# EAGLE design Controller (EAGLE 8.3.2)
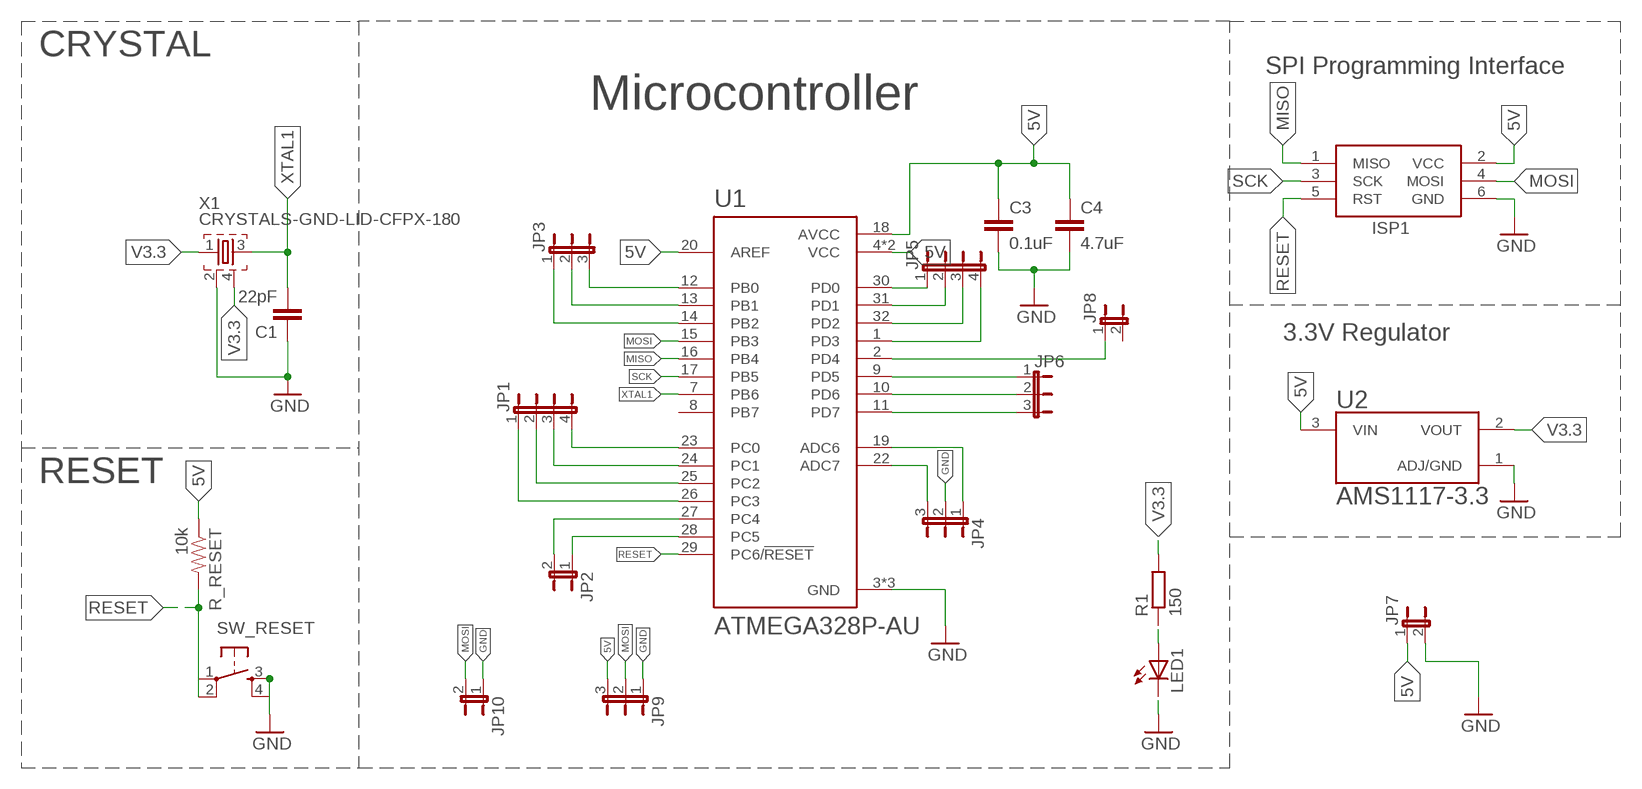
[diagram p0: schematic, sheet 1]

## Parts
C1  22pF  CAP0603-CAP  [0603-CAP]
C3  0.1uF  CAP0603-CAP  [0603-CAP]
C4  4.7uF  CAP0603-CAP  [0603-CAP]
ISP1  AVRISP-6  [AVRISP]
JP1  JP4E  [JP4]
JP2  JP1E  [JP1]
JP3  JP2E  [JP2]
JP4  JP2E  [JP2]
JP5  JP4E  [JP4]
JP6  JP2E  [JP2]
JP7  JP1E  [JP1]
JP8  JP1E  [JP1]
JP9  JP2E  [JP2]
JP10  JP1E  [JP1]
LED1  LEDSML0603  [SML0603]
R1  150  R-EU_R0603  [R0603]
R_RESET  10k  RESISTOR0603-RES  [0603-RES]
SW_RESET  TAC_SWITCHPTH  [TACTILE-PTH]
U1  ATMEGA328P-AU  [QFP80P900X900X120-32N]
U2  AMS1117-3.3  [SOT229P700X180-4N]
X1  CRYSTALS-GND-LID-CFPX-180  [3.4X2.7-4-PAD]

## Nets
5V: C3.1 C4.1 ISP1.2(VCC) JP7.1 JP9.3 R_RESET.1 U1.4(VCC) U1.6(VCC) U1.18(AVCC) U1.20(AREF) U2.3(VIN)
GND: C1.1 C3.2 C4.2 ISP1.6(GND) JP4.2 JP7.2 JP9.1 JP10.1 LED1.C SW_RESET.3 SW_RESET.4 U1.3(GND) U1.5(GND) U1.21(GND) U2.1(ADJ/GND) X1.2
MISO: ISP1.1(MISO) U1.16(PB4)
MOSI: ISP1.4(MOSI) JP9.2 JP10.2 U1.15(PB3)
N$1: LED1.A R1.1
N$2: JP1.4 U1.23(PC0)
N$3: JP1.3 U1.24(PC1)
N$4: JP1.2 U1.25(PC2)
N$5: JP1.1 U1.26(PC3)
N$6: JP2.2 U1.27(PC4)
N$7: SW_RESET.1
N$8: JP2.1 U1.28(PC5)
N$9: JP3.3 U1.12(PB0)
N$10: JP3.2 U1.13(PB1)
N$11: JP3.1 U1.14(PB2)
N$12: JP4.3 U1.22(ADC7)
N$13: JP4.1 U1.19(ADC6)
N$14: JP5.1 U1.30(PD0)
N$15: JP5.2 U1.31(PD1)
N$16: JP5.3 U1.32(PD2)
N$17: JP5.4 U1.1(PD3)
N$18: JP8.1 U1.2(PD4)
N$19: JP6.1 U1.9(PD5)
N$20: JP6.2 U1.10(PD6)
N$21: JP6.3 U1.11(PD7)
RESET: ISP1.5(RST) R_RESET.2 SW_RESET.2 U1.29(PC6/!RESET)
SCK: ISP1.3(SCK) U1.17(PB5)
V3.3: R1.2 U2.2(VOUT) X1.1 X1.4
XTAL1: C1.2 U1.7(PB6) X1.3
Unconnected: JP8.2 U1.8(PB7)

## Notes on the sheet
- CRYSTAL
- SPI Programming Interface
- Microcontroller
- 3.3V Regulator
- RESET

## Library data of the parts
C1 C3 C4 = SparkFun:CAP: Capacitor Standard 0603 ceramic capacitor, and 0.1" leaded capacitor.
ISP1 = adafruit:AVRISP: AVR ISP HEADER Standard 6 pin header for AVR programming
JP1 JP5 = jumper:JP4E: JUMPER
JP2 JP7 JP8 JP10 = jumper:JP1E: JUMPER
JP3 JP4 JP6 JP9 = jumper:JP2E: JUMPER
LED1 = led:LED: LED OSRAM: - CHIPLED LG R971, LG N971, LY N971, LG Q971, LY Q971, LO R971, LY R971 LH N974, LH R974 LS Q976, LO Q976, LY Q976 LO Q996 - Hyper CHIPLED LW Q18S LB Q993, LB Q99A, LB R99A - SideLED LS A670, LO A670, LY A670, LG A670, LP A670 LB A673, LV A673, LT A673, LW A673 LH A674 LY A675 LS A676, LA A676, LO A676, LY A676, LW A676 LS A679, LY A679, LG A679 - Hyper Micro SIDELED® LS Y876, LA Y876, LO Y876, LY Y876 LT Y87S - SmartLED LW L88C, LW L88S LB L89C, LB L89S, LG L890 LS L89K, LO L89K, LY L89K LS L896, LA L896, LO L896, LY L896 - TOPLED LS T670, LO T670, LY T670, LG T670, LP T670 LSG T670, LSP T670, LSY T670, LOP T670, LYG T670 LG T671, LOG T671, LSG T671 LB T673, LV T673, LT T673, LW T673 LH T674 LS T676, LA T676, LO T676, LY T676, LB T676, LH T676, LSB T676, LW T676 LB T67C, LV T67C, LT T67C, LS T67K, LO T67K, LY T67K, LW E67C LS E67B, LA E67B, LO E67B, LY E67B, LB E67C, LV E67C, LT E67C LW T67C LS T679, LY T679, LG T679 LS T770, LO T770, LY T770, LG T770, LP T770 LB T773, LV T773, LT T773, LW T773 LH T774 LS E675, LA E675, LY E675, LS T675 LS T776, LA T776, LO T776, LY T776, LB T776 LHGB T686 LT T68C, LB T68C - Hyper Mini TOPLED® LB M676 - Mini TOPLED Santana® LG M470 LS M47K, LO M47K, LY M47K Source: http://www.osram.convergy.de LUXEON: - LUMILED® LXK2-PW12-R00, LXK2-PW12-S00, LXK2-PW14-U00, LXK2-PW14-V00 LXK2-PM12-R00, LXK2-PM12-S00, LXK2-PM14-U00 LXK2-PE12-Q00, LXK2-PE12-R00, LXK2-PE12-S00, LXK2-PE14-T00, LXK2-PE14-U00 LXK2-PB12-K00, LXK2-PB12-L00, LXK2-PB12-M00, LXK2-PB14-N00, LXK2-PB14-P00, LXK2-PB14-Q00 LXK2-PR12-L00, LXK2-PR12-M00, LXK2-PR14-Q00, LXK2-PR14-R00 LXK2-PD12-Q00, LXK2-PD12-R00, LXK2-PD12-S00 LXK2-PH12-R00, LXK2-PH12-S00 LXK2-PL12-P00, LXK2-PL12-Q00, LXK2-PL12-R00 Source: www.luxeon.com KINGBRIGHT: KA-3528ASYC Source: www.kingbright.com
R1 = resistor:R-EU_: RESISTOR, European symbol
R_RESET = SparkFun:RESISTOR: Resistor Basic schematic elements and footprints for 0603, 1206, and PTH resistors.
SW_RESET = SparkFun:TAC_SWITCH: Momentary Switch Button commonly used for reset or general input. Spark Fun Electronics SKU : COM-00097
U1 = ATMEGA328P-AU:ATMEGA328P-AU: ATmega Series 20 MHz 32 KB Flash 2 KB SRAM 8-Bit Microcontroller - TQFP-32; AVAILABILITY: Good; DESCRIPTION: Microcontroller Mcu, 8 Bit, Atmega, 20mhz, Tqfp-32; MF: Microchip; MP: ATMEGA328P-AU; PACKAGE: TQFP-32 Microchip; PRICE: 2.19 USD
U2 = AMS1117-3.3:AMS1117-3.3: Sot223/Pkg 1-Amp 3.3-Volt Low Drop Out Voltage Regulatator; AVAILABILITY: Unavailable; DESCRIPTION: Sot223/Pkg 1-Amp 3.3-Volt Low Drop Out Voltage Regulatator; MF: Advanced Monolithic Systems; MP: AMS1117-3.3; PACKAGE: None; PRICE: None
X1 = IQD-Frequency-Products:CRYSTALS-GND-LID: CRYSTALS WITH CAN GROUNDED

## Board
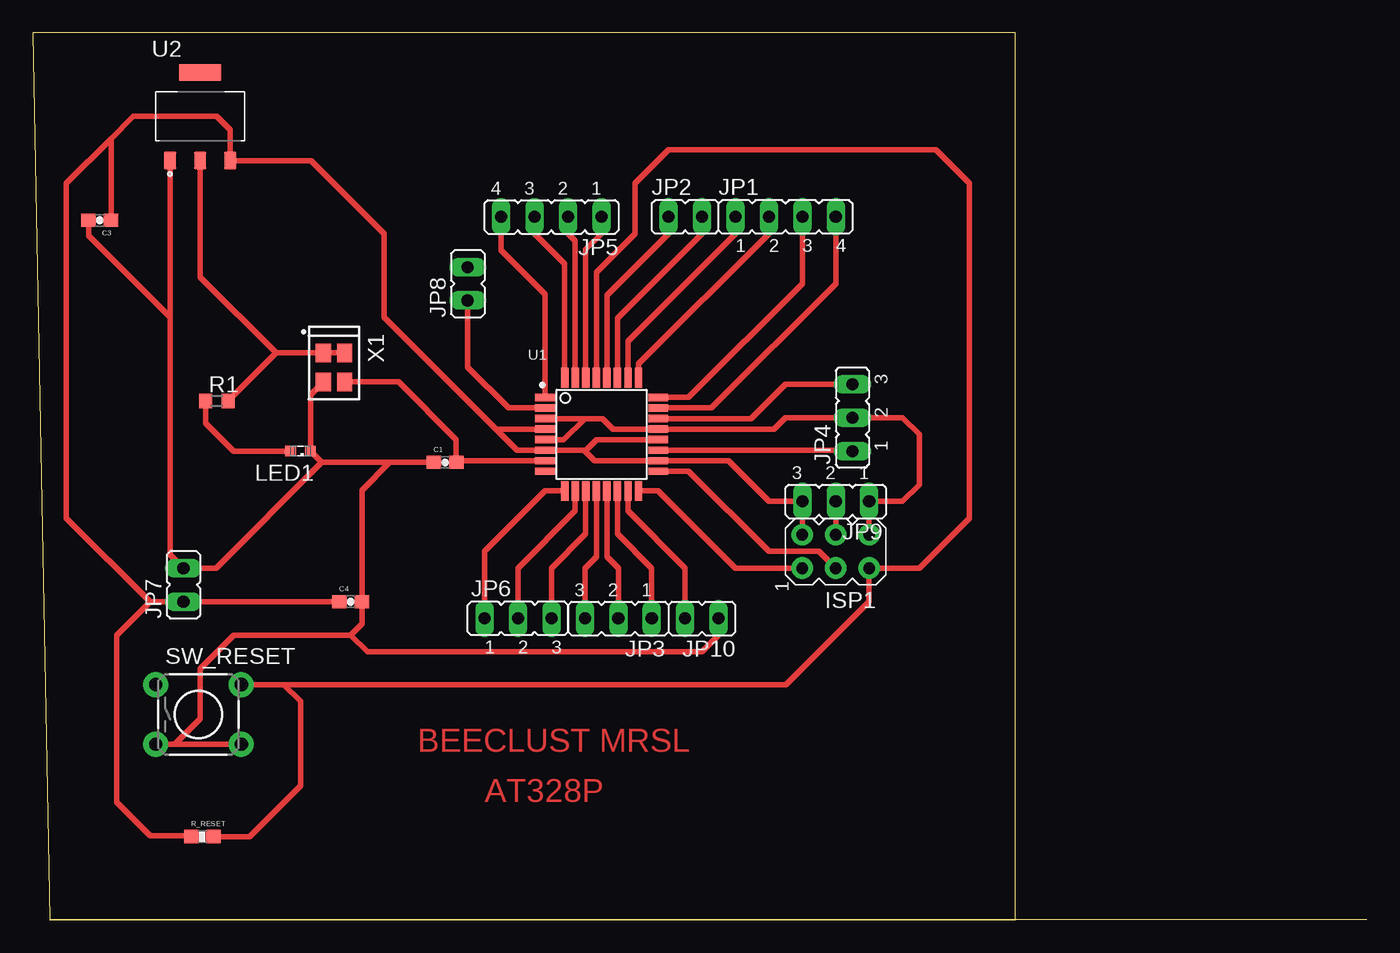
[diagram p1: board, top side]
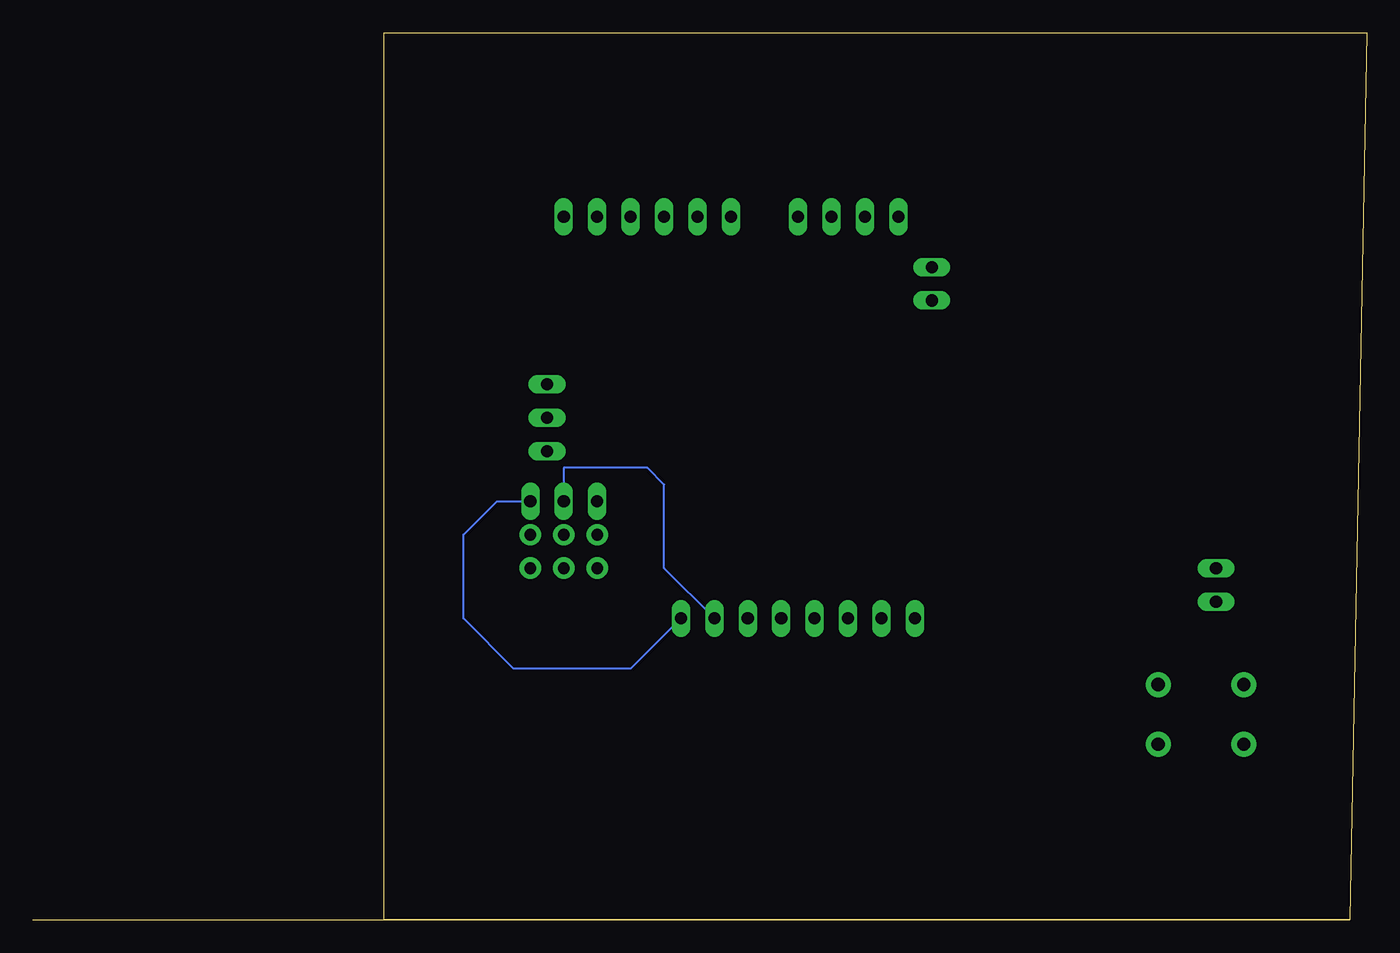
[diagram p2: board, bottom side, seen from below]

Size 101.27 x 67.31 mm. Coordinates in mm from the lower left corner, seen from the top.
Outline: 101.27,0 1.27,0
Outline: 1.27,0.01 74.6,0.01 74.6,67.31 0,67.31 1.27,0.01
Copper layers (1*16): Top 0.035mm / dielectric 1.5mm / Bottom 0.035mm
Design rules "default": minimum track width 6mil, minimum drill 0.35mm, track to track 6mil, track to pad 6mil, pad to pad 6mil, via to via 6mil, smd to smd 6mil, copper to edge 40mil, drill to drill 6mil, minimum pad ring 10mil, minimum via ring 8mil, stop-mask expansion 4mil, vias tented up to drill 0mil, thermal gap 10mil

### Footprints (pad centres in the part's own frame; a part is rotated, then mirrored left to right if it is on the bottom)
0603-CAP = smd 1.1 x 1: 1 -0.85,0; 2 0.85,0
AVRISP = drill 0.9 pad 1.626: 1 -1.27,2.54; 2 1.27,2.54; 3 -1.27,0; 4 1.27,0; 5 -1.27,-2.54; 6 1.27,-2.54
JP4 = drill 0.914 long: 1 -3.81,0; 2 -1.27,0; 3 1.27,0; 4 3.81,0
JP1 = drill 0.914 long: 1 0,-1.27; 2 0,1.27
JP2 = drill 0.914 long: 1 -2.54,0; 2 0,0; 3 2.54,0
SML0603 = smd 0.8 x 0.8: A 0.75,0; C -0.75,0
R0603 = smd 1 x 1.1: 1 -0.85,0; 2 0.85,0
0603-RES = smd 1.1 x 1: 1 -0.85,0; 2 0.85,0
TACTILE-PTH = drill 1.016 pad 1.88: 1 -3.251,2.261; 2 3.251,2.261; 3 -3.251,-2.261; 4 3.251,-2.261
QFP80P900X900X120-32N = smd 1.5 x 0.55: 1 -4.3,2.8; 2 -4.3,2; 3 -4.3,1.2; 4 -4.3,0.4; 5 -4.3,-0.4; 6 -4.3,-1.2; 7 -4.3,-2; 8 -4.3,-2.8; 17 4.3,-2.8; 18 4.3,-2; 19 4.3,-1.2; 20 4.3,-0.4; 21 4.3,0.4; 22 4.3,1.2; 23 4.3,2; 24 4.3,2.8 | smd 0.55 x 1.5: 9 -2.8,-4.3; 10 -2,-4.3; 11 -1.2,-4.3; 12 -0.4,-4.3; 13 0.4,-4.3; 14 1.2,-4.3; 15 2,-4.3; 16 2.8,-4.3; 25 2.8,4.3; 26 2,4.3; 27 1.2,4.3; 28 0.4,4.3; 29 -0.4,4.3; 30 -1.2,4.3; 31 -2,4.3; 32 -2.8,4.3
SOT229P700X180-4N = smd 0.93 x 1.31: 1 -2.29,-3.345; 2 0,-3.345; 3 2.29,-3.345 | smd 3.24 x 1.31: 4 0,3.345
3.4X2.7-4-PAD = smd 1.4 x 1.15: 1 -1.1,-0.8; 2 1.1,-0.8; 3 1.1,0.8; 4 -1.1,0.8

### Placement (x,y rotation side)
C1  31.3,34.71 0 top
C3  5.08,53.08 180 top
C4  24.13,24.14 0 top
ISP1  60.96,27.95 90 top
JP1  57.15,53.35 0 top
JP2  49.53,53.35 270 top
JP3  44.45,22.87 180 top
JP4  62.23,38.11 90 top
JP5  39.37,53.35 180 top
JP6  36.83,22.87 0 top
JP7  11.43,25.41 0 top
JP8  33.02,48.27 0 top
JP9  60.96,31.76 180 top
JP10  50.8,22.87 90 top
LED1  20.32,35.57 180 top
R1  13.97,39.38 0 top
R_RESET  12.87,6.31 0 top
SW_RESET  12.57,15.58 0 top
U1  43.18,36.84 0 top
U2  12.7,60.97 0 top
X1  22.86,41.92 270 top

### Tracks (layer width: path | path; a pad name or v marks a point on that pad's centre or on a via)
5V
  Top 0.406: 41.91,35.57 41.84,35.64 U1.6 36.76,35.64 35.16,37.24 | 41.91,35.57 42.78,36.44 U1.20 | 41.91,35.57 42.64,34.84 U1.18 52.8,34.84 55.88,31.76 JP9.3 ISP1.2 | C4.1 JP7.1 | 35.16,37.24 26.67,45.73 26.67,52.08 21.12,57.62 U2.3 14.99,59.95 13.97,60.97 7.62,60.97 5.93,59.28 | U1.4 35.16,37.24 | 5.93,59.28 C3.1 | JP7.1 8.89,24.14 | 8.89,24.14 6.35,21.6 6.35,8.9 8.89,6.36 11.97,6.36 R_RESET.1 | JP7.1 8.89,24.14 | 8.89,24.14 2.54,30.49 2.54,55.89 5.93,59.28
GND
  Top 0.406: 41.91,38.04 U1.3 | 41.91,38.04 43.25,38.04 44.05,37.24 U1.21 56.28,37.24 57.15,38.11 JP4.2 66.04,38.11 67.31,36.84 67.31,33.03 66.04,31.76 JP9.1 ISP1.6 | U1.5 40.31,36.44 41.91,38.04 | 27.08,34.71 C1.1 | 27.08,34.71 24.98,32.61 C4.2 24.98,22.45 24.13,21.6 | 21.93,34.71 LED1.C 21.07,39.83 X1.2 | 21.93,34.71 27.08,34.71 | 10.41,45.73 U2.1 | 10.41,45.73 10.41,27.7 JP7.2 13.9,26.68 21.93,34.71 | C3.2 4.23,51.91 10.41,45.73 | SW_RESET.4 SW_RESET.3 10.77,13.32 12.7,15.25 12.7,19.06 15.24,21.6 24.13,21.6 | 24.13,21.6 25.4,20.33 50.8,20.33 52.07,21.6 JP10.1
  Bottom 0.152: JP10.1 55.88,19.06 64.77,19.06 68.58,22.87 68.58,29.22 66.04,31.76 JP9.1
MISO
  Top 0.406: U1.16 47.48,32.54 53.34,26.68 ISP1.1
MOSI
  Top 0.406: U1.15 45.18,31.03 49.53,26.68 JP10.2 | ISP1.4 JP9.2
  Bottom 0.152: JP10.2 53.34,26.68 53.34,33.03 54.61,34.3 60.96,34.3 JP9.2
N$1
  Top 0.406: LED1.A 15.24,35.57 13.12,37.69 R1.1
N$2
  Top 0.406: U1.23 51.53,38.84 60.96,48.27 JP1.4
N$3
  Top 0.406: U1.24 49.79,39.64 58.42,48.27 JP1.3
N$4
  Top 0.406: U1.25 45.98,42.18 55.88,52.08 JP1.2
N$5
  Top 0.406: U1.26 45.18,43.92 53.34,52.08 JP1.1
N$6
  Top 0.406: U1.27 44.38,45.66 50.8,52.08 JP2.2
N$8
  Top 0.406: U1.28 43.58,47.4 48.26,52.08 JP2.1
N$9
  Top 0.406: U1.12 42.78,27.55 41.91,26.68 JP3.3
N$10
  Top 0.406: U1.13 43.58,27.55 44.45,26.68 JP3.2
N$11
  Top 0.406: U1.14 44.38,29.29 46.99,26.68 JP3.1
N$12
  Top 0.406: U1.22 54.54,38.04 57.15,40.65 JP4.3
N$13
  Top 0.406: U1.19 62.16,35.64 JP4.1
N$14
  Top 0.406: U1.30 41.98,50.88 43.18,52.08 JP5.1
N$15
  Top 0.406: U1.31 41.18,51.54 40.64,52.08 JP5.2
N$16
  Top 0.406: U1.32 40.38,49.8 38.1,52.08 JP5.3
N$17
  Top 0.406: U1.1 38.88,47.49 35.56,50.81 JP5.4
N$18
  Top 0.406: U1.2 36.1,38.84 33.02,41.92 JP8.1
N$19
  Top 0.406: JP6.1 34.29,27.95 38.88,32.54 U1.9
N$20
  Top 0.406: U1.10 41.18,31.03 36.83,26.68 JP6.2
N$21
  Top 0.406: U1.11 41.98,29.29 39.37,26.68 JP6.3
RESET
  Top 0.406: U1.29 42.78,49.14 45.72,52.08 45.72,55.89 48.26,58.43 68.58,58.43 71.12,55.89 71.12,30.49 67.31,26.68 ISP1.5 63.5,24.14 57.2,17.84 19.05,17.84 | 19.05,17.84 SW_RESET.2 | R_RESET.2 16.46,6.31 20.32,10.17 20.32,16.57 19.05,17.84
SCK
  Top 0.406: U1.17 49.79,34.04 55.88,27.95 59.69,27.95 ISP1.3
V3.3
  Top 0.406: X1.4 X1.1 18.46,43.02 | 18.46,43.02 R1.2 | U2.2 12.7,48.78 18.46,43.02
XTAL1
  Top 0.406: U1.7 32.28,34.84 C1.2 32.15,36.44 27.77,40.82 X1.3

### Text on the board
Top: BEECLUST MRSL | AT328P